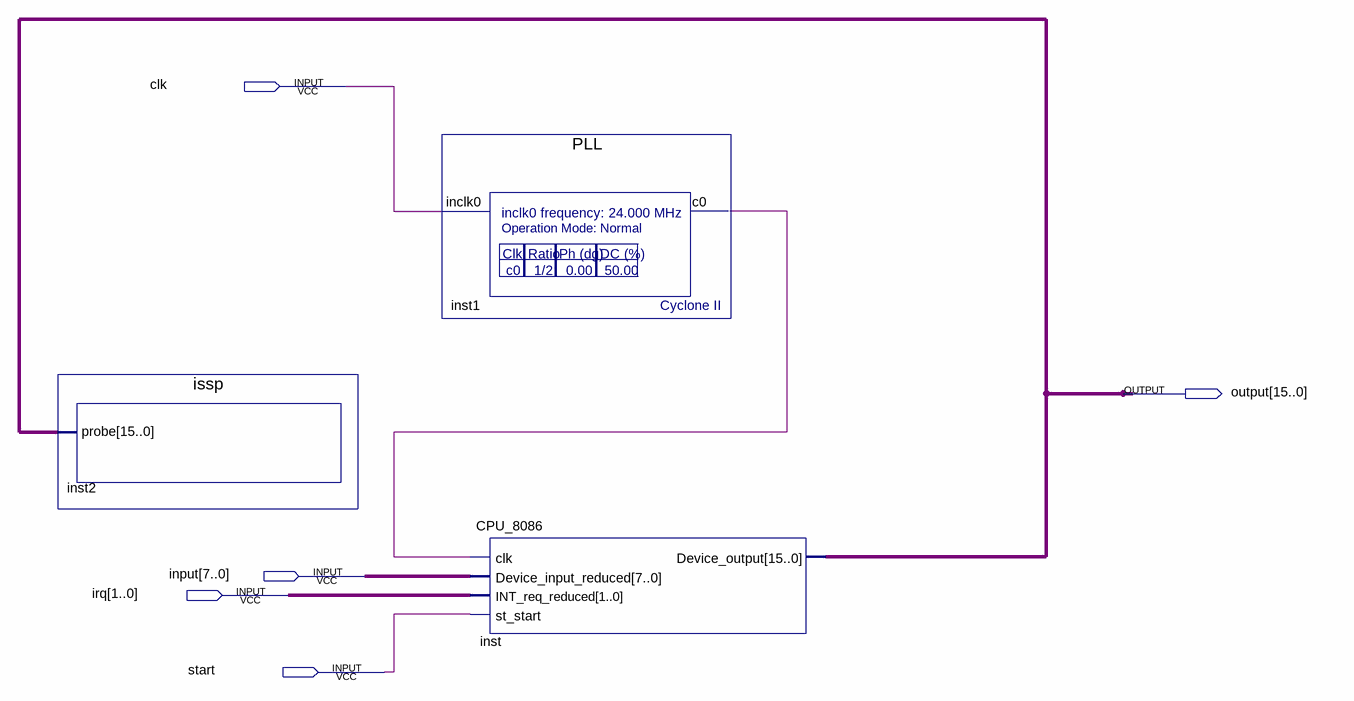
[diagram p0: schematic sheet]
// Quartus schematic Test_Bench.bdf as structural Verilog: 3 symbols, 5 pins
module Test_Bench (
  input  clk,
  input  [7:0] \input ,
  input  [1:0] irq,
  input  start,
  output [15:0] \output 
);

  wire inst1_c0;

  issp inst2 (.probe(\output ));
  PLL inst1 (.inclk0(clk), .c0(inst1_c0));
  CPU_8086 inst (
    .clk(inst1_c0), .Device_input_reduced(\input ), .INT_req_reduced(irq), .st_start(start),
    .Device_output(\output ));
endmodule
